# Altium schematic sheet LM2596.SchDoc
size A4
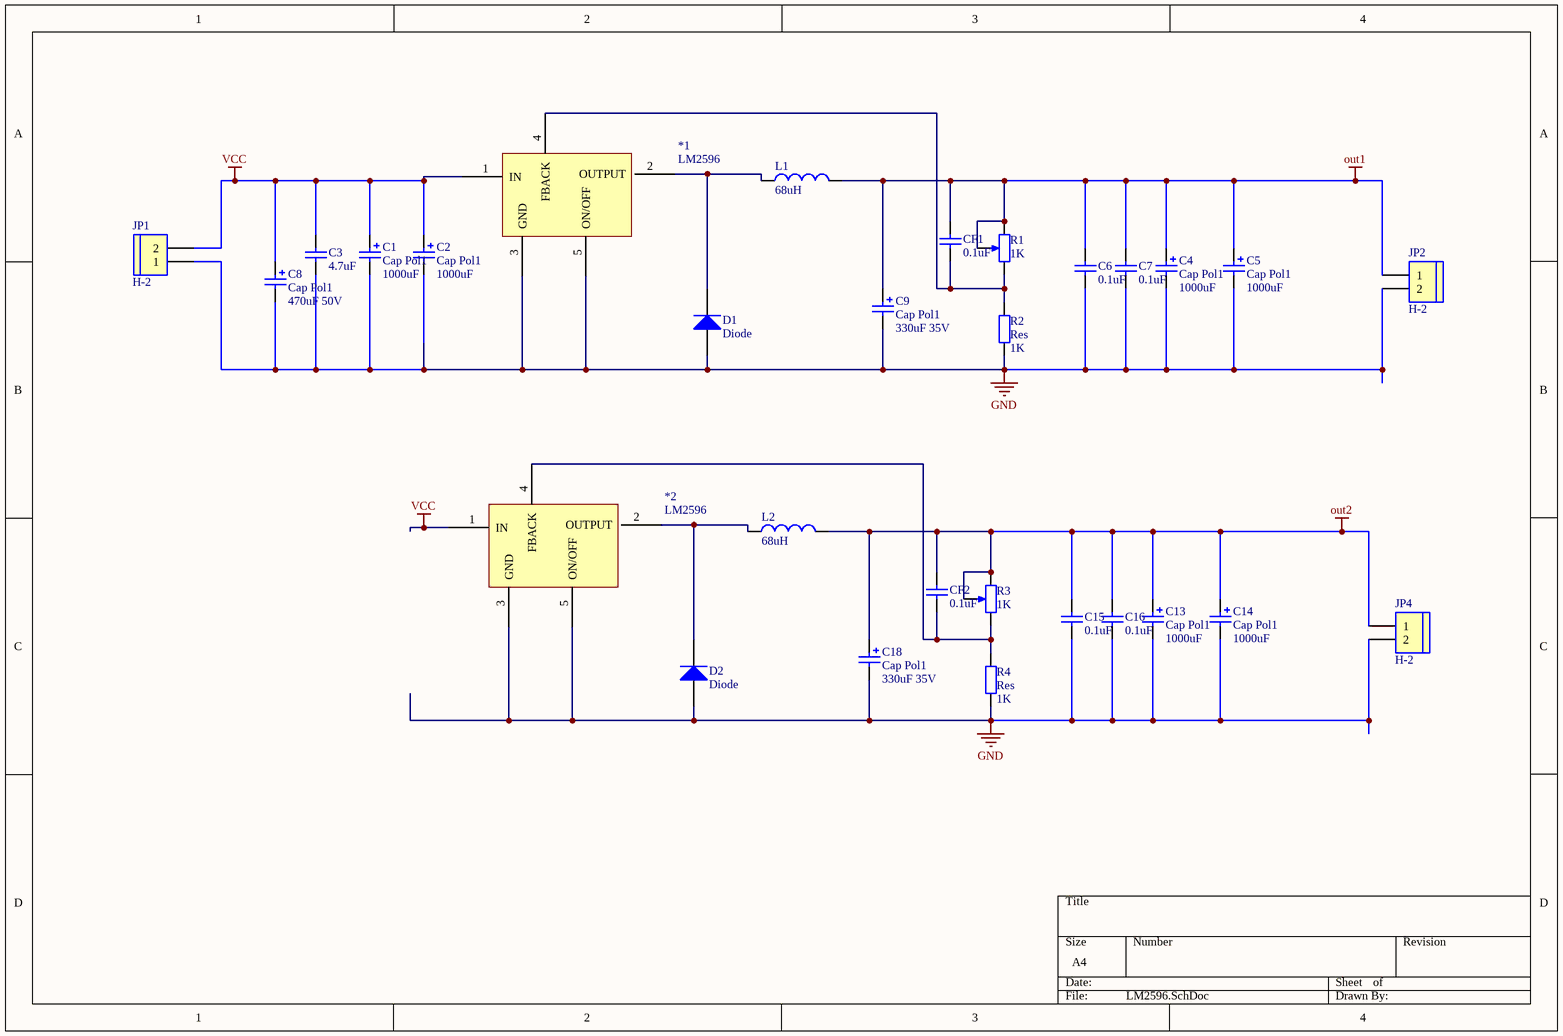
[diagram p0: LM2596.SchDoc]

## Parts
*1  LM2596  [HDR1-5]
*2  LM2596  [HDR1-5]
C1  Cap Pol1  value 1000uF  [RB0.3-0.65]
C2  Cap Pol1  value 1000uF  [RB0.3-0.65]
C3  value 4.7uF  [CC1005-0402]  (hidden comment: CAP)
C4  Cap Pol1  value 1000uF  [RB0.3-0.65]
C5  Cap Pol1  value 1000uF  [RB0.3-0.65]
C6  value 0.1uF  [CC1005-0402]  (hidden comment: CAP)
C7  value 0.1uF  [CC1005-0402]  (hidden comment: CAP)
C8  Cap Pol1  value 470uF 50V  [RB0.3-0.65]
C9  Cap Pol1  value 330uF 35V  [RB0.3-0.65]
C13  Cap Pol1  value 1000uF  [RB0.3-0.65]
C14  Cap Pol1  value 1000uF  [RB0.3-0.65]
C15  value 0.1uF  [CC1005-0402]  (hidden comment: CAP)
C16  value 0.1uF  [CC1005-0402]  (hidden comment: CAP)
C18  Cap Pol1  value 330uF 35V  [RB0.3-0.65]
CF1  value 0.1uF  [CC1005-0402]  (hidden comment: CAP)
CF2  value 0.1uF  [CC1005-0402]  (hidden comment: CAP)
D1  Diode  [Diode-5817]
D2  Diode  [Diode-5817]
JP1  H-2  [JP-2]
JP2  H-2  [JP-2]
JP4  H-2  [JP-2]
L1  value 68uH  [RBL0.2]  (hidden comment: INDUCTOT)
L2  value 68uH  [RBL0.2]  (hidden comment: INDUCTOT)
R1  value 1K  [VR-S]  (hidden comment: RES-Pot2)
R2  Res  value 1K  [1n4148]
R3  value 1K  [VR-S]  (hidden comment: RES-Pot2)
R4  Res  value 1K  [1n4148]

## Nets
GND: *1.3(GND) *1.5(ON/OFF) *2.3(GND) *2.5(ON/OFF) C1.2 C2.2 C3.1 C4.2 C5.2 C6.1 C7.1 C8.2 C9.2 C13.2 C14.2 C15.1 C16.1 C18.2 D1.1(A) D2.1(A) JP1.1 JP2.2 JP4.2 R2.1 R4.1
out1: C4.1 C5.1 C6.2 C7.2 C9.1 CF1.2 JP2.1 L1.2 R1.2(TAP) R1.3(TOP)
out2: C13.1 C14.1 C15.2 C16.2 C18.1 CF2.2 JP4.1 L2.2 R3.2(TAP) R3.3(TOP)
VCC: *1.1(IN) *2.1(IN) C1.1 C2.1 C3.2 C8.1 JP1.2
Net*1_2: *1.2(OUTPUT) D1.2(K) L1.1
Net*1_4: *1.4(FBACK) CF1.1 R1.1(BOT) R2.2
Net*2_2: *2.2(OUTPUT) D2.2(K) L2.1
Net*2_4: *2.4(FBACK) CF2.1 R3.1(BOT) R4.2

## Library data of the parts
C1 C2 C4 C5 C8 C9 C13 C14 C18 = Cap Pol1: Polarized Capacitor (Radial); Manufacturer: Generic Components; Class: Passive; Published: 08/06/2000; Publisher: Altium Hobart Technology Centre; SubClass: Capacitor
C3 C6 C7 C15 C16 CF1 CF2 = CAP: Capacitor; Manufacturer: Generic Components; Class: Passive; Published: 08/06/2000; Publisher: Altium Hobart Technology Centre; SubClass: Capacitor
D1 D2 = Diode: Default Diode; Manufacturer: Generic Components; Class: Discrete; SubClass: Diode - Switching; Published: 08/06/2000; Publisher: Altium Hobart Technology Centre
JP1 JP2 JP4 = H-2: Header, 2-Pin; Manufacturer: Generic Components; Class: Connector
L1 L2 = INDUCTOT: Inductor; Manufacturer: Generic Components; Class: Passive; Published: 08/06/2000; Publisher: Altium Hobart Technology Centre; SubClass: Inductor
R1 R3 = RES-Pot2: Potentiometer; Class: Passive; SubClass: Potentiometer
R2 R4 = Res: Resistor; Manufacturer: Generic Components; Class: Passive; Published: 08/06/2000; Publisher: Altium Hobart Technology Centre; SubClass: Resistor